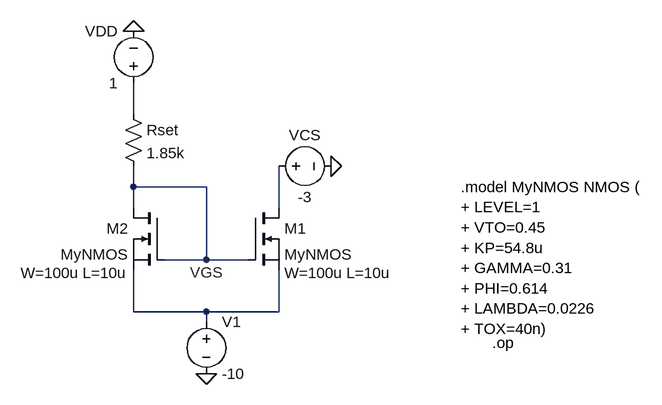
[diagram p0: schematic Current_Source.asc]
Current_Source.asc, the LTspice schematic file:
Version 4.1
SHEET 1 880 680
WIRE -192 -128 -192 -176
WIRE -192 -16 -192 -48
WIRE -80 -16 -192 -16
WIRE -192 16 -192 -16
WIRE 32 16 32 -48
WIRE -80 96 -80 -16
WIRE -80 96 -144 96
WIRE -16 96 -80 96
WIRE -192 176 -192 112
WIRE -80 176 -192 176
WIRE 32 176 32 112
WIRE 32 176 -80 176
WIRE -80 192 -80 176
FLAG -192 -256 0
FLAG -80 96 VGS
FLAG -80 272 0
FLAG 112 -48 0
SYMBOL nmos -16 16 R0
WINDOW 39 56 100 Left 2
SYMATTR SpiceLine W=100u L=10u
SYMATTR InstName M1
SYMATTR Value MyNMOS
SYMBOL voltage -192 -160 R180
WINDOW 0 24 96 Left 2
WINDOW 3 24 16 Left 2
WINDOW 123 0 0 Left 0
WINDOW 39 0 0 Left 0
SYMATTR InstName VDD
SYMATTR Value 1
SYMBOL res -208 -144 R0
SYMATTR InstName Rset
SYMATTR Value 1.85k
SYMBOL nmos -144 16 M0
WINDOW 39 56 100 Left 2
SYMATTR SpiceLine W=100u L=10u
SYMATTR InstName M2
SYMATTR Value MyNMOS
SYMBOL voltage 16 -48 R270
WINDOW 0 32 56 VTop 2
WINDOW 3 -32 56 VBottom 2
SYMATTR InstName VCS
SYMATTR Value -3
SYMBOL voltage -80 176 R0
WINDOW 123 0 0 Left 0
WINDOW 39 0 0 Left 0
SYMATTR InstName V1
SYMATTR Value -10
TEXT 312 -16 Left 2 !.model MyNMOS NMOS (\n+ LEVEL=1\n+ VTO=0.45\n+ KP=54.8u\n+ GAMMA=0.31\n+ PHI=0.614\n+ LAMBDA=0.0226\n+ TOX=40n)
TEXT 360 224 Left 2 !.op

The netlist it stands for:
* Current_Source.asc
M1 N002 VGS N003 N003 MyNMOS W=100u L=10u
VDD N001 0 1
Rset N001 VGS 1.85k
M2 VGS VGS N003 N003 MyNMOS W=100u L=10u
VCS N002 0 -3
V1 N003 0 -10
.model NMOS NMOS
.model PMOS PMOS
.lib standard.mos
.model MyNMOS NMOS (
+ LEVEL=1
+ VTO=0.45
+ KP=54.8u
+ GAMMA=0.31
+ PHI=0.614
+ LAMBDA=0.0226
+ TOX=40n)
.op
.backanno
.end